# Altium project recall_mcu_v0_1.PrjPcb
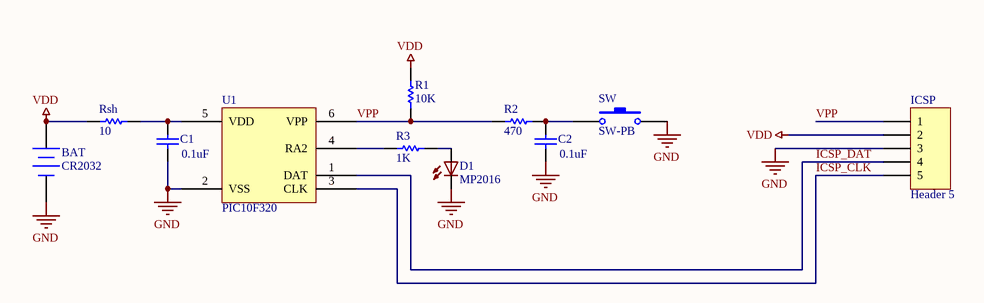
[diagram p0: recall_mcu_v0_1.SchDoc]
1 sheet, 11 parts. Net scope: global (net labels, ports and power ports of the same name join across sheets).
Board file: recall_mcu_v0_1.PcbDoc

## Sheet recall_mcu_v0_1.SchDoc
size A

### Parts
BAT  CR2032  [BAT-HLD-001-THM]
C1  value 0.1uF  [CAP_0402R]  (hidden comment: CAP)
C2  value 0.1uF  [CAP_0402R]  (hidden comment: CAP)
D1  MP2016  [MP2016]
ICSP  Header 5  [HDR1X5_ICSP]
R1  value 10K  [RES_0402]  (hidden comment: RES)
R2  value 470  [RES_0402]  (hidden comment: RES)
R3  value 1K  [RES_0402]  (hidden comment: RES)
Rsh  value 10  [RES_0402]  (hidden comment: RES)
SW  SW-PB  [TRELLIS_1x1]
U1  PIC10F320  [SOT-23-6]

### Nets
GND: BAT.2(-) C1.1 C2.1 D1.C ICSP.3 SW.2 U1.2(VSS)
VDD: BAT.1(+) ICSP.2 R1.2 Rsh.1
ICSP_CLK: ICSP.5 U1.3(CLK)
ICSP_DAT: ICSP.4 U1.1(DAT)
VPP: ICSP.1 R1.1 R2.2 U1.6(VPP)
NetC1_2: C1.2 Rsh.2 U1.5(VDD)
NetC2_2: C2.2 R2.1 SW.1
NetD1_A: D1.A R3.1
NetR3_2: R3.2 U1.4(RA2)

### Library data of the parts
BAT = Battery: Published: 24-Mar-1999; LatestRevisionDate: 17-Jul-2002; LatestRevisionNote: Re-released for DXP Platform.; PackageReference: BAT-2; Publisher: Altium Limited; PackageDescription: Battery; 2 Leads
C1 C2 = CAP: Capacitor; Published: 8-Jun-2000; LatestRevisionDate: 29-May-2009; LatestRevisionNote: IPC-7351 Footprint Added.; PackageReference: C1206; Publisher: Altium Limited; PackageDescription: Chip Capacitor
D1 = MP2016: MP2016 White LED
ICSP = Header 5: Header, 5-Pin; LatestRevisionDate: 17-Jul-2002; LatestRevisionNote: Re-released for DXP Platform.; Publisher: Altium Limited
R1-R3 Rsh = RES: Resistor; Published: 8-Jun-2000; LatestRevisionDate: 17-Jul-2002; LatestRevisionNote: Re-released for DXP Platform.; PackageReference: AXIAL-0.3; Publisher: Altium Limited; PackageDescription: Axial Device, Thru-Hole; 2 Leads; 0.3 in Pin Spacing
SW = SW-PB: Translucent Conductive Silicone Elastomer Switch; Published: 24-Mar-1999; LatestRevisionDate: 17-Jul-2002; LatestRevisionNote: Re-released for DXP Platform.; PackageReference: SPST-2; Publisher: Altium Limited; PackageDescription: Switch; 2 Leads
U1 = PIC10F320: 6-Pin Flash-Based, 8-Bit Microcontroller